# EAGLE schematic Keg Cop - Daisy Chain RJ45 T with Slots (EAGLE 9.5.2)
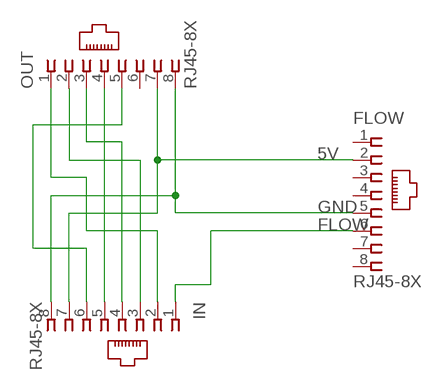
[diagram p0: schematic, sheet 1]

## Parts
FLOW  RJ45-8X  [RJ45-NO-SHIELD]
IN  RJ45-8X  [RJ45-NO-SHIELD]
OUT  RJ45-8X  [RJ45-NO-SHIELD]

## Nets
5V: FLOW.2 IN.7 OUT.7
FLOW: FLOW.6 IN.1
GND: FLOW.5 IN.8 OUT.8
N$1: IN.2 OUT.1
N$2: IN.3 OUT.2
N$3: IN.4 OUT.3
N$5: IN.5 OUT.4
N$7: IN.6 OUT.5
Unconnected: FLOW.1 FLOW.3 FLOW.4 FLOW.7 FLOW.8 OUT.6

## Library data of the parts
FLOW IN OUT = con-tycoelectronics:RJ45: CORCOM Modular RJ Jacks No Shield Source: www.tycoelectronics.com .. ENG_DS_1654001_1099_RJ_L_0507.pdf; MPN: RJ45-8X; OC_FARNELL: unknown; OC_NEWARK: 16R6101